# Altium project braking_io.PrjPcb (part 1 of 3)
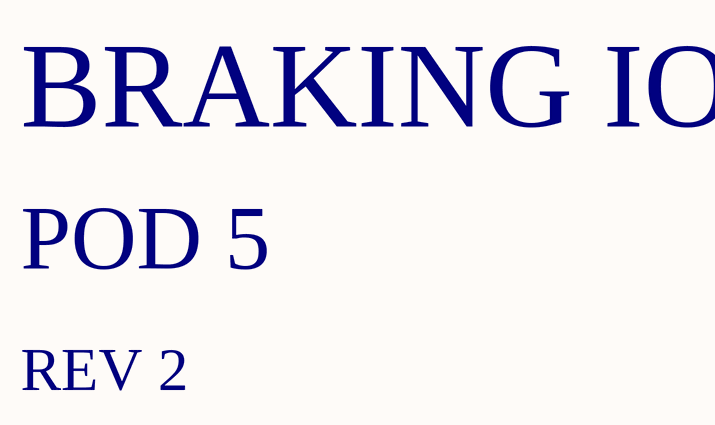
[diagram p0: braking_io.SchDoc]
11 sheets, 381 parts. Net scope: global (net labels, ports and power ports of the same name join across sheets).
Board file: braking_io.PcbDoc
Sheets:
  braking_io.SchDoc
  bus_filter.SchDoc
  power_7V.SchDoc
  power_5V.SchDoc
  power_24V.SchDoc
  solenoid.SchDoc
  solenoid_drv.SchDoc
  pressure.SchDoc
  telemetry_adc.SchDoc
  retro.SchDoc
  unity_gain_buffer.SchDoc

## Sheet braking_io.SchDoc: Braking IO PCB
size A4; Organization: Badgerloop Electrical; Address1: 133 Engineering Research Building; Address2: 1500 Engineering Drive; Address3: Madison, Wi 53706

### Notes on the sheet
- BRAKING IO
- POD 5
- REV 2
- Title
- Engineer:
- Date:
- Time:
- Revision:
- Sheet
- of
- File:

## Sheet bus_filter.SchDoc: Bus Filter
size A4; Organization: Badgerloop Electrical; Address1: 133 Engineering Research Building; Address2: 1500 Engineering Drive; Address3: Madison, Wi 53706
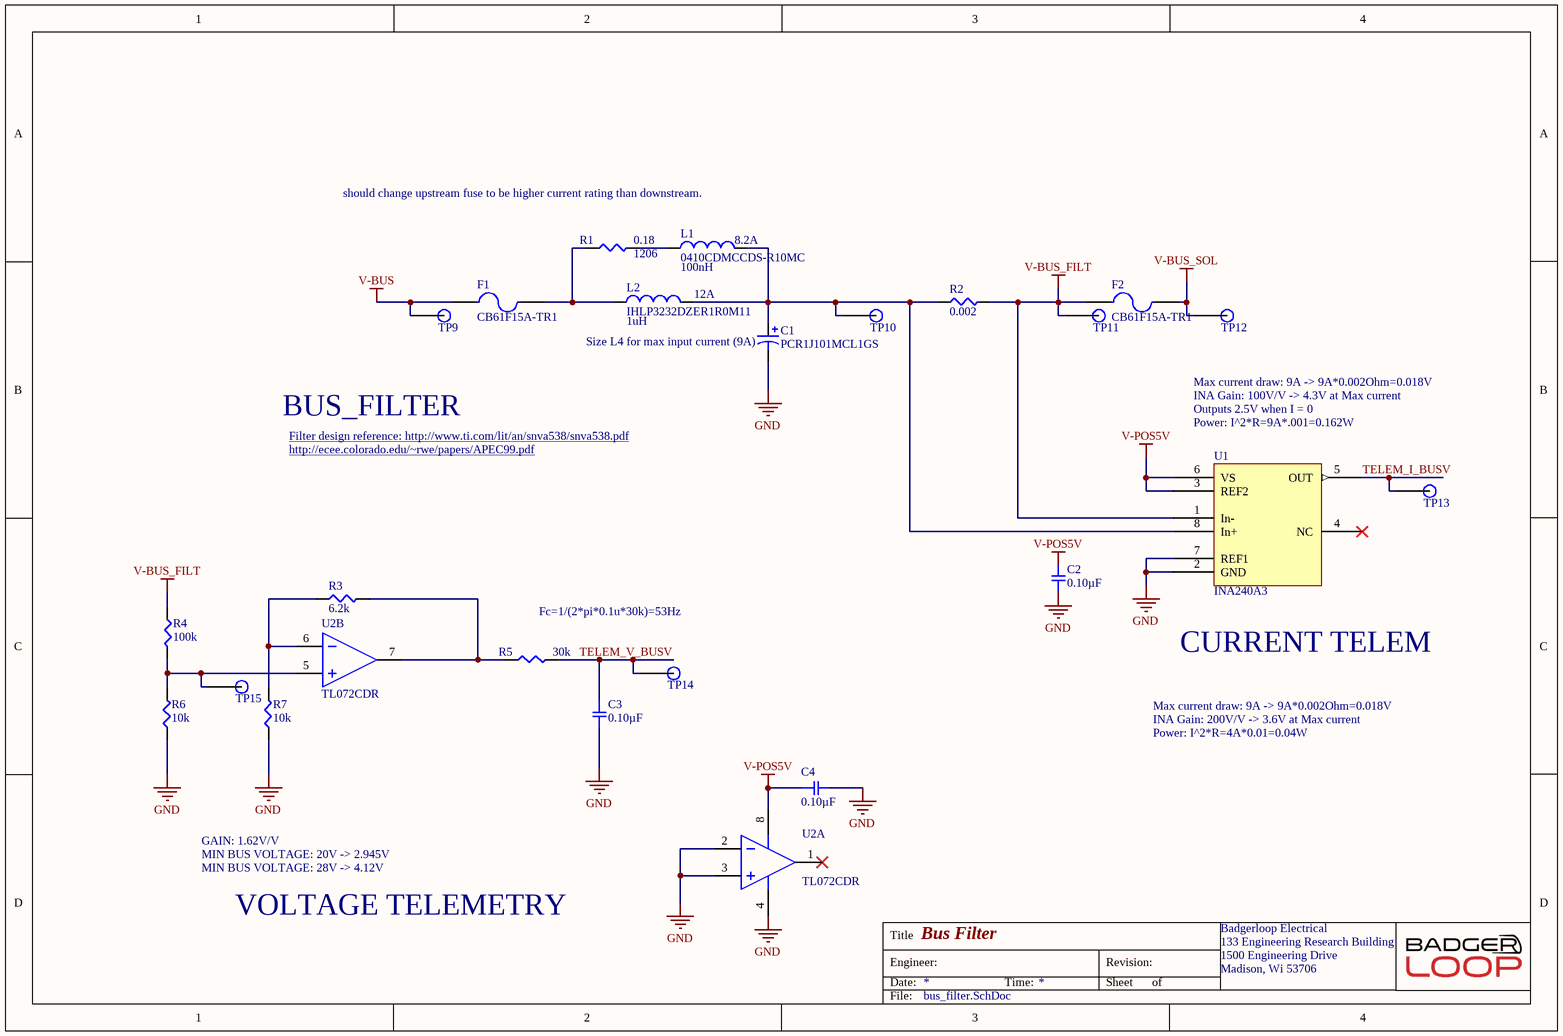
[diagram p1: bus_filter.SchDoc]

### Parts
C1  PCR1J101MCL1GS  [CAPAE110103X126M]
C2  0.10µF  [SMD-0805C]
C3  0.10µF  [SMD-0805C]
C4  0.10µF  [SMD-0805C]
F1  CB61F15A-TR1  [RESC6132X26N]
F2  CB61F15A-TR1  [RESC6132X26N]
L1  0410CDMCCDS-R10MC  Inductance: 100nH  Saturation Current: 8.2A  [INDM4442X20N]
L2  IHLP3232DZER1R0M11  Saturation Current: 12A  Inductance: 1uH  [INDM8682X40N]
R1  0.18  Supplier Device Package: 1206  [SMD-1206-RES]
R2  0.002  [SMD-1206-RES]
R3  6.2k  [SMD-0805-RES]
R4  100k  [SMD-0805-RES]
R5  30k  [SMD-0805-RES]
R6  10k  [SMD-0805-RES]
R7  10k  [SMD-0805-RES]
TP9  TP  [Test Point]  (value not drawn)
TP10  TP  [Test Point]  (value not drawn)
TP11  TP  [Test Point]  (value not drawn)
TP12  TP  [Test Point]  (value not drawn)
TP13  TP  [Test Point]  (value not drawn)
TP14  TP  [Test Point]  (value not drawn)
TP15  TP  [Test Point]  (value not drawn)
U1  INA240A3  [SOIC127P600X175-8N]
U2  TL072CDR  [SOP127P600X175-8N]  (parts A,B of 2)

### Nets
GND: C1.2 C2.1 C3.2 C4.2 R6.1 R7.1 U1.2(GND) U1.7(REF1) U2.2(IN-) U2.3(IN+) U2.4(V-)
V-BUS: F1.1 TP9.1
V-BUS_FILT: F2.1 R2.2 R4.1 TP11.1 U1.1(In-)
V-BUS_SOL: F2.2 TP12.1
V-POS5V: C2.2 C4.1 U1.3(REF2) U1.6(VS) U2.8(V+)
TELEM_I_BUSV: TP13.1 U1.5(OUT)
TELEM_V_BUSV: C3.1 R5.2 TP14.1
NetC1_1: C1.1 L1.2 L2.2 R2.1 TP10.1 U1.8(In+)
NetF1_2: F1.2 L2.1 R1.1
NetL1_1: L1.1 R1.2
NetR3_1: R3.1 R7.2 U2.6(IN-)
NetR3_2: R3.2 R5.1 U2.7(OUT)
NetR4_2: R4.2 R6.2 TP15.1 U2.5(IN+)

Not connected (* = marked no-connect by the designer): U1 4(NC)*; U2 1(OUT)*

### Notes on the sheet
- should change upstream fuse to be higher current rating than downstream.
- (near C1) Size L4 for max input current (9A)
- Max current draw: 9A -> 9A*0.002Ohm=0.018V
- BUS_FILTER
- Filter design reference: http://www.ti.com/lit/an/snva538/snva538.pdf <http://www.ti.com/lit/an/snva538/snva538.pdf>
- INA Gain: 100V/V -> 4.3V at Max current
- (near U1) Power: I^2*R=9A*.001=0.162W
- Outputs 2.5V when I = 0
- http://ecee.colorado.edu/~rwe/papers/APEC99.pdf
- Fc=1/(2*pi*0.1u*30k)=53Hz
- CURRENT TELEM
- INA Gain: 200V/V -> 3.6V at Max current
- Power: I^2*R=4A*0.01=0.04W
- GAIN: 1.62V/V
- MIN BUS VOLTAGE: 20V -> 2.945V
- MIN BUS VOLTAGE: 28V -> 4.12V
- VOLTAGE TELEMETRY
- Title
- Engineer:
- Date:
- Time:
- Revision:
- Sheet
- of
- File:

### Library data of the parts
C1 = PCR1J101MCL1GS: CAP ALUM POLY 100UF 20% 63V SMD; Manufacturer: Nichicon; ESR (Equivalent Series Resistance): 24mR; Ripple Current: 3A; Leakage Current: 3uA; Life (Hours): 4000Hour; Dissipation Factor: 0.08%; Supplier 1: Digi-Key; Manufacturer Part Number: PCR1J101MCL1GS; Stock 1: 11476; Pricing 1: 1=3.63000, 10=2.92800, 100=2.28380 (USD); RoHS: Yes; Mount: Surface Mount,PCB; Case/Package: Radial; Weight: 0.045856oz; Min Operating Temperature: -55°C; Max Operating Temperature: 125°C; Capacitance: 100uF; Tolerance: 20%; Voltage Rating (DC): 63V; Package Quantity: 1; Packaging: Tape and Reel; Voltage Rating: 63V; Termination: SMD/SMT; Voltage: 63V; Diameter: 10mm; Length: 12.7mm; Height: 12.7mm; Height - Seated (Max): 0.504inch; Depth: 10.3mm; Lead Pitch: 4.6mm; Lead Free: Lead Free; ComponentLink1URL: https://datasheet.ciiva.com/29551/e-ch-ta-29551389.pdf?src-supplier=Digi-Key; ComponentLink1Description: https://datasheet.ciiva.com/29551/e-ch-ta-29551389.pdf?src-supplier=Digi-Key; ComponentLink2URL: https://datasheet.ciiva.com/29551/e-ch-ta-29551390.pdf?src-supplier=Digi-Key; ComponentLink2Description: https://datasheet.ciiva.com/29551/e-ch-ta-29551390.pdf?src-supplier=Digi-Key; ComponentLink3URL: https://datasheet.ciiva.com/29551/e-ch-ta-29551391.pdf?src-supplier=Digi-Key; ComponentLink3Description: https://datasheet.ciiva.com/29551/e-ch-ta-29551391.pdf?src-supplier=Digi-Key; Supplier Part Number 1: 493-13783-1-ND
C2 C4 = GRM21B7U1A104JA01L: CAP CER 0.1UF 10V U2J 0805; Manufacturer: Murata Electronics North America; Factory Stock: 0; Unit Price (USD): 0.4; Minimum Quantity: 1; Tolerance: ±5%; Datasheets: http://www.murata.com/~/media/webrenewal/support/library/catalog/products/capacitor/mlcc/c02e.pdf; Image: //media.digikey.com/Renders/Murata%20Renders/0805%20(2012%20Metric)%20.85mm.jpg; Digi-Key Part Number: 490-11592-1-ND; Part Number: GRM21B7U1A104JA01L; Quantity Available: 3390; @ qty: 0; Packaging: Cut Tape (CT); Series: GRM; Part Status: Active; Value: 0.10µF; Voltage: 10V; Temperature Coefficient: U2J; Operating Temperature: -55°C ~ 125°C; Features: -; Ratings: -; Applications: General Purpose; Mounting Type: Surface Mount, MLCC; Package / Case: 0805 (2012 Metric); Size / Dimension: 0.079" L x 0.049" W (2.00mm x 1.25mm); Height - Seated (Max): -; Thickness (Max): 0.053" (1.35mm); Lead Spacing: -; Lead Style: -
C3 = GRM219R71C104KA01D: CAP CER 0.1UF 16V X7R 0805; Manufacturer: Murata Electronics North America; Factory Stock: 0; Unit Price (USD): 0.13; Minimum Quantity: 1; Tolerance: ±10%; Datasheets: http://www.murata.com/~/media/webrenewal/support/library/catalog/products/capacitor/mlcc/c02e.pdf; Image: //media.digikey.com/Renders/Murata%20Renders/0805%20(2012%20Metric)%20.85mm.jpg; Digi-Key Part Number: 490-1683-1-ND; Part Number: GRM219R71C104KA01D; Quantity Available: 265464; @ qty: 0; Packaging: Cut Tape (CT); Series: GRM; Part Status: Active; Value: 0.10µF; Voltage: 16V; Temperature Coefficient: X7R; Operating Temperature: -55°C ~ 125°C; Features: -; Ratings: -; Applications: General Purpose; Mounting Type: Surface Mount, MLCC; Package / Case: 0805 (2012 Metric); Size / Dimension: 0.079" L x 0.049" W (2.00mm x 1.25mm); Height - Seated (Max): -; Thickness (Max): 0.037" (0.95mm); Lead Spacing: -; Lead Style: -
F1 F2 = CB61F15A-TR1: Manufacturer: Eaton; Current Rating: 15A; Voltage Rating (AC): 125V; DC Cold Resistance: 4mR; Fuse Type: Board Mount (Cartridge Style Excluded); Approvals: cULus,PSE; Supplier 1: Digi-Key; Manufacturer Part Number: CB61F15A-TR1; Stock 1: 11809; Pricing 1: 1=1.15000, 5=1.11800, 10=1.04600, 50=0.86600, 100=0.72160, 250=0.70356, 500=0.59532 (USD); RoHS: Yes; Mount: Surface Mount; Case/Package: SMD/SMT; Packaging: Tape and Reel; Voltage Rating (DC): 125V; Voltage Rating: 125V; Length: 0.24inch; Height: 0.101inch; Width: 0.101inch; Depth: 2.57mm; Lead Free: Lead Free; ComponentLink1URL: http://components.arrow.com/part/dataview/0323_05918082?src-supplier=Arrow+Europe; ComponentLink1Description: http://components.arrow.com/part/dataview/0323_05918082?src-supplier=Arrow+Europe; ComponentLink2URL: http://www.cooperindustries.com/content/dam/public/bussmann/Electronics/Resources/product-datasheets/bus-elx-ds-4377-cb61f.pdf?src-supplier=Avnet+Asia; ComponentLink2Description: http://www.cooperindustries.com/content/dam/public/bussmann/Electronics/Resources/product-datasheets/bus-elx-ds-4377-cb61f.pdf?src-supplier=Avnet+Asia; ComponentLink3URL: http://www.cooperindustries.com/content/dam/public/bussmann/Electronics/Resources/product-datasheets/bus-elx-ds-4377-cb61f.pdf?src-supplier=Avnet; ComponentLink3Description: http://www.cooperindustries.com/content/dam/public/bussmann/Electronics/Resources/product-datasheets/bus-elx-ds-4377-cb61f.pdf?src-supplier=Avnet; ComponentLink4URL: http://www.cooperindustries.com/content/dam/public/bussmann/Electronics/Resources/product-datasheets/bus-elx-ds-4377-cb61f.pdf?src-supplier=Digi-Key; ComponentLink4Description: http://www.cooperindustries.com/content/dam/public/bussmann/Electronics/Resources/product-datasheets/bus-elx-ds-4377-cb61f.pdf?src-supplier=Digi-Key; Supplier Part Number 1: 283-4104-1-ND
L1 = 0410CDMCCDS-R10MC: Manufacturer: Sumida; Supplier 1: Digi-Key; Manufacturer Part Number: 0410CDMCCDS-R10MC; Stock 1: 5994; Pricing 1: 1=0.93000, 10=0.81700, 100=0.58360, 500=0.49024, 1000=0.39687 (USD); RoHS: No; Supplier Part Number 1: 308-2523-1-ND
L2 = IHLP3232DZER1R0M11: Fixed Inductors 1uH 20% Low Profile; Manufacturer: Vishay Dale; Core Material: Metal,Composite,Ferrite; Current Rating: 18.2A; Shielding: Shielded; Self Resonant Frequency: 49MHz; DC Resistance (DCR): 4.63mR; Test Frequency: 100kHz; Supplier 1: Digi-Key; Manufacturer Part Number: IHLP3232DZER1R0M11; Stock 1: 9463; Pricing 1: 1=1.61000, 10=1.49500, 100=1.08100 (USD); RoHS: Yes; Mount: Surface Mount; Case/Package: 3232; Number of Pins: 2; Min Operating Temperature: -55°C; Max Operating Temperature: 125°C; Inductance Tolerance: 20%; Packaging: Tape and Reel; Tolerance: 20%; Package Quantity: 500; Max DC Current: 18.2A; Termination: SMD/SMT; RMS Current (Irms): 18.2A; Military Standard: Not; Length: 8.64mm; Height: 4mm; Width: 0.322inch; Height - Seated (Max): 0.157inch; Depth: 8.94mm; Radiation Hardening: No; REACH SVHC: Unknown; Lead Free: Lead Free; ComponentLink1URL: https://datasheet.ciiva.com/6692/ihlp-3232dz-11-6692199.pdf?src-supplier=Digi-Key; ComponentLink1Description: https://datasheet.ciiva.com/6692/ihlp-3232dz-11-6692199.pdf?src-supplier=Digi-Key; ComponentLink2URL: https://datasheet.ciiva.com/6692/ihlp-3232dz-11-6692200.pdf?src-supplier=Digi-Key; ComponentLink2Description: https://datasheet.ciiva.com/6692/ihlp-3232dz-11-6692200.pdf?src-supplier=Digi-Key; ComponentLink3URL: https://datasheet.ciiva.com/6692/ihlp-3232dz-11-6692201.pdf?src-supplier=Digi-Key; ComponentLink3Description: https://datasheet.ciiva.com/6692/ihlp-3232dz-11-6692201.pdf?src-supplier=Digi-Key; ComponentLink4URL: https://datasheet.ciiva.com/17113/70231623-17113262.pdf?src-supplier=Allied+Electronics; ComponentLink4Description: https://datasheet.ciiva.com/17113/70231623-17113262.pdf?src-supplier=Allied+Electronics; Supplier Part Number 1: 541-1348-1-ND
R1 = ERJ-8BSFR18V: RES SMD 0.18 OHM 1% 1/2W 1206; Manufacturer: Panasonic Electronic Components; Factory Stock: 0; Unit Price (USD): 0.11739; @ qty: 1500; Minimum Quantity: 1; Power (Watts): 0.5W, 1/2W; Temperature Coefficient: ±250ppm/°C; Part Number: ERJ-8BSFR18V; Datasheets: https://industrial.panasonic.com/cdbs/www-data/pdf/RDA0000/AOA0000C239.pdf; Image: //media.digikey.com/Renders/Panasonic%20Renders/ERJ-1206%20Pkg.jpg; Digi-Key Part Number: P17683CT-ND; Quantity Available: 1772; Packaging: Cut Tape (CT); Series: ERJ; Part Status: Active; Value: 0.18; Tolerance: ±1%; Composition: Thick Film; Features: Automotive AEC-Q200, Current Sense; Operating Temperature: -55°C ~ 125°C; Package / Case: 1206 (3216 Metric); Size / Dimension: 0.126" L x 0.063" W (3.20mm x 1.60mm); Height - Seated (Max): 0.028" (0.70mm); Number of Terminations: 2; Failure Rate: -
R2 = CSNL1206FT2L00TR: RES SMD 0.002 OHM 1% 1W 1206; Manufacturer: Stackpole Electronics; Resistance: 2mR; Temperature Coefficient: 50ppm/°C; ComponentLink1URL: https://www.seielect.com/Catalog/SEI-CSNL.pdf?src-supplier=Avnet; ComponentLink1Description: https://www.seielect.com/Catalog/SEI-CSNL.pdf?src-supplier=Avnet; ComponentLink2URL: https://www.seielect.com/catalog/SEI-Packaging.pdf?src-supplier=Digi-Key; ComponentLink2Description: https://www.seielect.com/catalog/SEI-Packaging.pdf?src-supplier=Digi-Key; Supplier 1: Digi-Key; Manufacturer Part Number: CSNL1206FT2L00; Stock 1: 23112; Pricing 1: 1=0.68, 10=0.566, 25=0.4852, 50=0.4366, 100=0.38, 250=0.33956, 500=0.2749, 1000=0.22234 (USD); Mount: Surface Mount; Case/Package: 1206; Case Code (Metric): 3216; Case Code (Imperial): 1206; Contact Plating: Tin,Matte; Min Operating Temperature: -55°C; Max Operating Temperature: 170°C; Packaging: Tape and Reel; Tolerance: 1%; Power Rating: 1W; Composition: Metal Foil; Number of Terminations: 2; Max Power Dissipation: 1W; Features: Moisture Resistant; Length: 0.126inch; Height: 0.035inch; Width: 0.063inch; Radiation Hardening: No; Lead Free: Lead Free; Supplier Part Number 1: CSNL1206FT2L00DKR-ND
R3 = ERJ-P06J622V: RES SMD 6.2K OHM 5% 1/2W 0805; Manufacturer: Panasonic Electronic Components; Factory Stock: 0; Unit Price (USD): 0.01839; @ qty: 1500; Minimum Quantity: 1; Power (Watts): 0.5W, 1/2W; Temperature Coefficient: ±200ppm/°C; Part Number: ERJ-P06J622V; Datasheets: https://industrial.panasonic.com/cdbs/www-data/pdf/RDA0000/AOA0000C243.pdf; Image: //media.digikey.com/Renders/Panasonic%20Renders/ERJ-0805%20Pkg.jpg; Digi-Key Part Number: P6.2KADCT-ND; Quantity Available: 14652; Packaging: Cut Tape (CT); Series: ERJ; Part Status: Active; Value: 6.2k; Tolerance: ±5%; Composition: Thick Film; Features: Automotive AEC-Q200, Pulse Withstanding; Operating Temperature: -55°C ~ 155°C; Package / Case: 0805 (2012 Metric); Supplier Device Package: 0805; Size / Dimension: 0.079" L x 0.049" W (2.00mm x 1.25mm); Height - Seated (Max): 0.028" (0.70mm); Number of Terminations: 2; Failure Rate: -
R4 = ERJ-P06J104V: RES SMD 100K OHM 5% 1/2W 0805; Manufacturer: Panasonic Electronic Components; Factory Stock: 0; Unit Price (USD): 0.01839; @ qty: 1500; Minimum Quantity: 1; Power (Watts): 0.5W, 1/2W; Temperature Coefficient: ±200ppm/°C; Part Number: ERJ-P06J104V; Datasheets: https://industrial.panasonic.com/cdbs/www-data/pdf/RDA0000/AOA0000C243.pdf; Image: //media.digikey.com/Renders/Panasonic%20Renders/ERJ-0805%20Pkg.jpg; Digi-Key Part Number: P100KADCT-ND; Quantity Available: 82264; Packaging: Cut Tape (CT); Series: ERJ; Part Status: Active; Value: 100k; Tolerance: ±5%; Composition: Thick Film; Features: Automotive AEC-Q200, Pulse Withstanding; Operating Temperature: -55°C ~ 155°C; Package / Case: 0805 (2012 Metric); Supplier Device Package: 0805; Size / Dimension: 0.079" L x 0.049" W (2.00mm x 1.25mm); Height - Seated (Max): 0.028" (0.70mm); Number of Terminations: 2; Failure Rate: -
R5 = ERJ-6ENF3002V: RES SMD 30K OHM 1% 1/8W 0805; Manufacturer: Panasonic Electronic Components; Factory Stock: 0; Unit Price (USD): 0.00729; @ qty: 1500; Minimum Quantity: 1; Power (Watts): 0.125W, 1/8W; Temperature Coefficient: ±100ppm/°C; Part Number: ERJ-6ENF3002V; Datasheets: http://industrial.panasonic.com/www-cgi/jvcr13pz.cgi?E+PZ+3+AOA0002+ERJ6ENF3002V+7+WW; Image: //media.digikey.com/Renders/Panasonic%20Renders/ERJ-0805%20Pkg.jpg; Digi-Key Part Number: P30.0KCCT-ND; Quantity Available: 88046; Packaging: Cut Tape (CT); Series: ERJ; Part Status: Active; Value: 30k; Tolerance: ±1%; Composition: Thick Film; Features: Automotive AEC-Q200; Operating Temperature: -55°C ~ 155°C; Package / Case: 0805 (2012 Metric); Supplier Device Package: 0805; Size / Dimension: 0.079" L x 0.049" W (2.00mm x 1.25mm); Height - Seated (Max): 0.028" (0.70mm); Number of Terminations: 2; Failure Rate: -
R6 R7 = ERJ-P06J103V: RES SMD 10K OHM 5% 1/2W 0805; Manufacturer: Panasonic Electronic Components; Factory Stock: 0; Unit Price (USD): 0.01839; @ qty: 1500; Minimum Quantity: 1; Power (Watts): 0.5W, 1/2W; Temperature Coefficient: ±200ppm/°C; Part Number: ERJ-P06J103V; Datasheets: https://industrial.panasonic.com/cdbs/www-data/pdf/RDA0000/AOA0000C243.pdf; Image: //media.digikey.com/Renders/Panasonic%20Renders/ERJ-0805%20Pkg.jpg; Digi-Key Part Number: P10KADCT-ND; Quantity Available: 413576; Packaging: Cut Tape (CT); Series: ERJ; Part Status: Active; Value: 10k; Tolerance: ±5%; Composition: Thick Film; Features: Automotive AEC-Q200, Pulse Withstanding; Operating Temperature: -55°C ~ 155°C; Package / Case: 0805 (2012 Metric); Supplier Device Package: 0805; Size / Dimension: 0.079" L x 0.049" W (2.00mm x 1.25mm); Height - Seated (Max): 0.028" (0.70mm); Number of Terminations: 2; Failure Rate: -
TP9-TP15 = TP: SMD TEST POINT
U1 = INA240A3: IC AMP CURRENT SENSE 8-TSSOP 100V/V; Manufacturer: Texas Instruments; Number of Circuits: 1; Slew Rate: 2V/µs; -3db Bandwidth: 400kHz; Input Bias Current: 90uA; Input Offset Voltage (Vos): 5uV; Operating Supply Current: 1.8mA; Supplier 1: Digi-Key; Stock 1: 4680; Pricing 1: 1=2.65, 10=2.377, 25=2.2428, 100=1.7943, 250=1.56996, 500=1.52512, 1000=1.21113 (USD); Mount: Surface Mount; Case/Package: TSSOP; Number of Pins: 8; Min Operating Temperature: -40°C; Max Operating Temperature: 125°C; Packaging: Tape and Reel; ComponentLink1URL: http://www.ti.com/general/docs/lit/getliterature.tsp?genericPartNumber=INA240&fileType=pdf&src-supplier=Farnell; ComponentLink1Description: http://www.ti.com/general/docs/lit/getliterature.tsp?genericPartNumber=INA240&fileType=pdf&src-supplier=Farnell; ComponentLink2URL: http://www.ti.com/lit/ds/symlink/ina240.pdf?src-supplier=Digi-Key; ComponentLink2Description: http://www.ti.com/lit/ds/symlink/ina240.pdf?src-supplier=Digi-Key; Supplier Part Number 1: 296-45090-1-ND
U2 = TL072CDR: IC OPAMP JFET 3MHZ 8SOIC; Manufacturer: Texas Instruments; Voltage Gain: 106.02dB; Min Dual Supply Voltage: 3.5V; Max Dual Supply Voltage: 18V; Nominal Supply Current: 5mA; Common Mode Rejection Ratio: 70dB; Number of Channels: 2; Slew Rate: 13V/µs; Max I/O Voltage: 10mV; Input Bias Current: 200pA; Operating Supply Current: 1.4mA; Dual Supply Voltage: 9V; Supplier 1: Digi-Key; Stock 1: 21821; Pricing 1: 1=0.41, 10=0.334, 100=0.2059, 500=0.1562, 1000=0.11715 (USD); Case/Package: D; Number of Pins: 8; Contact Plating: Gold; Min Operating Temperature: -40°C; Max Operating Temperature: 85°C; Package Quantity: 1; Packaging: Tape and Reel; Unity Gain Bandwidth Product: 3MHz; Bandwidth: 3MHz; Nominal Gain Bandwidth Product: 3MHz; Number of Circuits: 2; Gain Bandwidth Product: 3MHz; Input Offset Voltage (Vos): 10mV; Number of Elements: 2; Max Supply Voltage: 18V; Number of Amplifiers: 2; Length: 4.9mm; Height: 1.58mm; Width: 3.91mm; Radiation Hardening: No; Lead Free: Lead Free; REACH SVHC: No SVHC; ComponentLink1URL: http://www.ti.com/lit/ds/symlink/tl071a.pdf?src-supplier=Digi-Key; ComponentLink1Description: http://www.ti.com/lit/ds/symlink/tl071a.pdf?src-supplier=Digi-Key; ComponentLink2URL: http://www.ti.com/general/docs/lit/getliterature.tsp?genericPartNumber=TL072&&fileType=pdf&src-supplier=Avnet; ComponentLink2Description: http://www.ti.com/general/docs/lit/getliterature.tsp?genericPartNumber=TL072&&fileType=pdf&src-supplier=Avnet; ComponentLink3URL: http://www.farnell.com/datasheets/1882732.pdf?src-supplier=Element14; ComponentLink3Description: http://www.farnell.com/datasheets/1882732.pdf?src-supplier=Element14; Supplier Part Number 1: 296-1282-6-ND

## Sheet power_7V.SchDoc: 7V SUPPLY
size A4; Organization: Badgerloop Electrical; Address1: 133 Engineering Research Building; Address2: 1500 Engineering Drive; Address3: Madison, Wi 53706
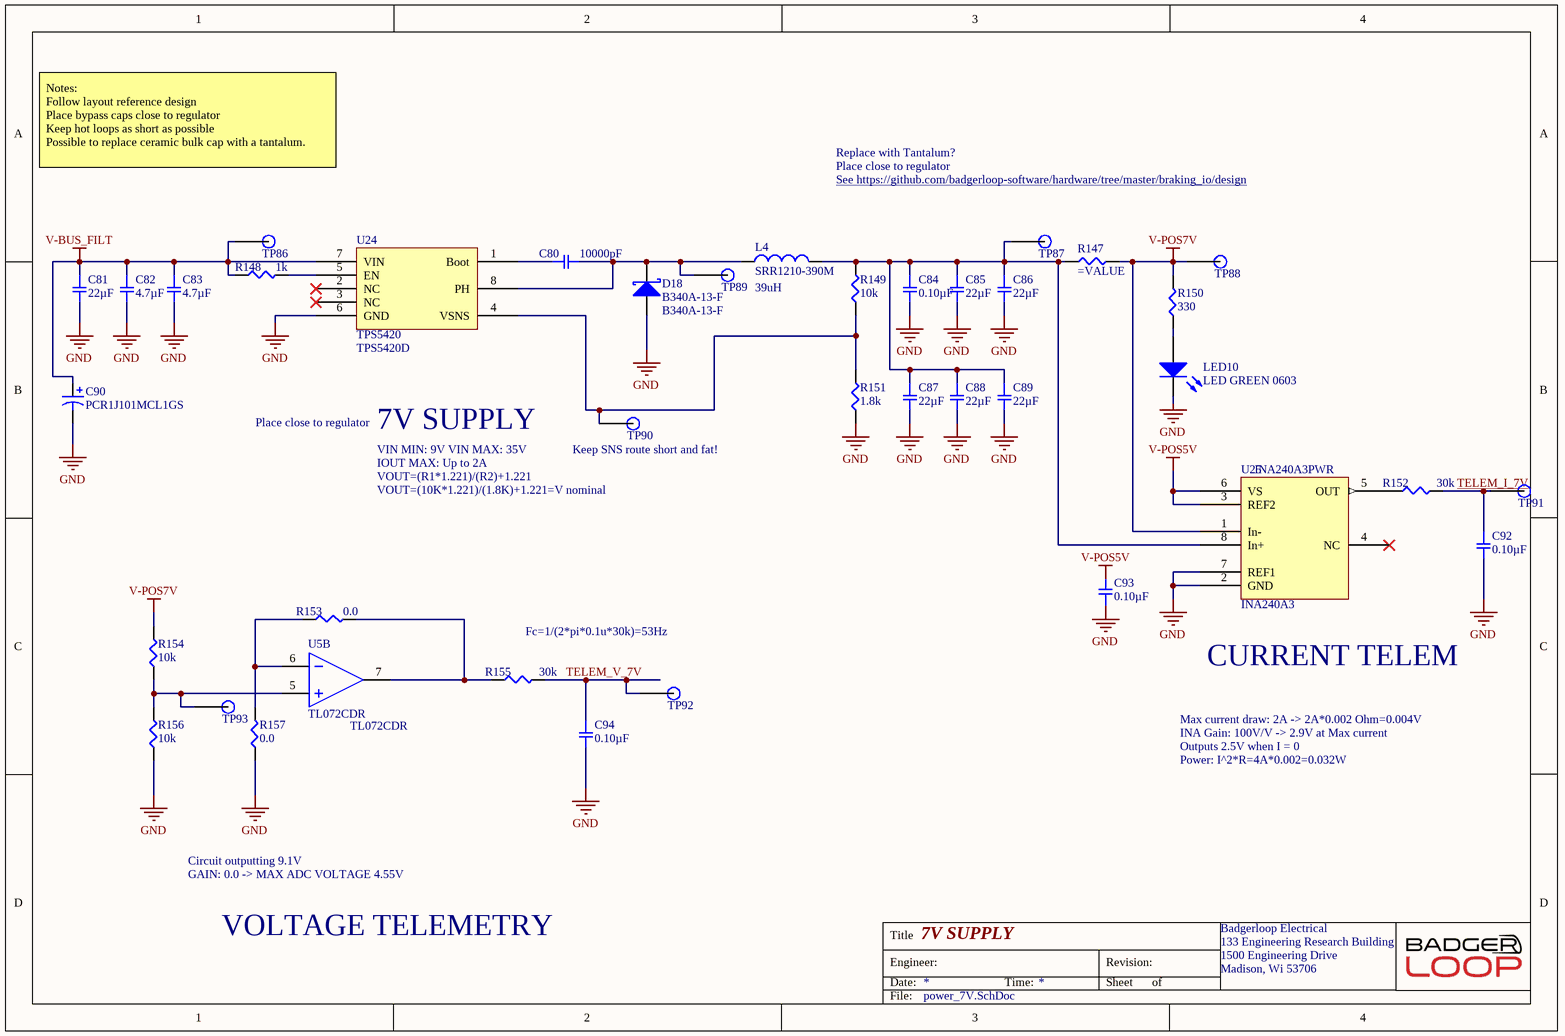
[diagram p2: power_7V.SchDoc]

### Parts
C80  10000pF  [SMD-0805C]
C81  22µF  [SMD-1206C]
C82  4.7µF  [SMD-1206C]
C83  4.7µF  [SMD-1206C]
C84  0.10µF  [SMD-0805C]
C85  22µF  [SMD-1206C]
C86  22µF  [SMD-1206C]
C87  22µF  [SMD-1206C]
C88  22µF  [SMD-1206C]
C89  22µF  [SMD-1206C]
C90  PCR1J101MCL1GS  [CAPAE110103X126M]
C92  0.10µF  [SMD-0805C]
C93  0.10µF  [SMD-0805C]
C94  0.10µF  [SMD-0805C]
D18  B340A-13-F  [DIOM4326X20N]
L4  SRR1210-390M  Inductance: 39uH  [INDM120120X100N]
LED10  LED GREEN 0603  [LED 0603 GREEN]
R147  (no value)  [SMD-1206-RES]
R148  1k  [SMD-0805-RES]
R149  10k  [SMD-0805-RES]
R150  330  [SMD-0805-RES]
R151  1.8k  [SMD-0805-RES]
R152  30k  [SMD-0805-RES]
R153  0.0  [SMD-0805-RES]
R154  10k  [SMD-0805-RES]
R155  30k  [SMD-0805-RES]
R156  10k  [SMD-0805-RES]
R157  0.0  [SMD-0805-RES]
TP86  TP  [Test Point]  (value not drawn)
TP87  TP  [Test Point]  (value not drawn)
TP88  TP  [Test Point]  (value not drawn)
TP89  TP  [Test Point]  (value not drawn)
TP90  TP  [Test Point]  (value not drawn)
TP91  TP  [Test Point]  (value not drawn)
TP92  TP  [Test Point]  (value not drawn)
TP93  TP  [Test Point]  (value not drawn)
U5  TL072CDR  [SOP127P600X175-8N]  (part B of 2)
U24  TPS5420  Manufacturer Part Number: TPS5420D  [SOP127P600X175-8N]
U25  INA240A3  Manufacturer Part Number: INA240A3PWR  [SOIC127P600X175-8N]

### Nets
GND: C81.2 C82.2 C83.2 C84.2 C85.2 C86.2 C87.2 C88.2 C89.2 C90.2 C92.2 C93.1 C94.2 D18.1(A) LED10.2(K) R151.1 R156.1 R157.1 U24.6(GND) U25.2(GND) U25.7(REF1)
V-BUS_FILT: C81.1 C82.1 C83.1 C90.1 R148.1 TP86.1 U24.7(VIN)
V-POS5V: C93.2 U25.3(REF2) U25.6(VS)
V-POS7V: R147.2 R150.2 R154.2 TP88.1 U25.1(In-)
TELEM_I_7V: C92.1 R152.2 TP91.1
TELEM_V_7V: C94.1 R155.2 TP92.1
NetC80_1: C80.1 U24.1(Boot)
NetC80_2: C80.2 D18.2(K) L4.1 TP89.1 U24.8(PH)
NetC84_1: C84.1 C85.1 C86.1 C87.1 C88.1 C89.1 L4.2 R147.1 R149.2 TP87.1 U25.8(In+)
NetLED10_1: LED10.1(A) R150.1
NetR148_2: R148.2 U24.5(EN)
NetR149_1: R149.1 R151.2 TP90.1 U24.4(VSNS)
NetR152_1: R152.1 U25.5(OUT)
NetR153_1: R153.1 R157.2 U5.6(IN-)
NetR153_2: R153.2 R155.1 U5.7(OUT)
NetR154_1: R154.1 R156.2 TP93.1 U5.5(IN+)

Not connected (* = marked no-connect by the designer): U24 2(NC)* 3(NC)*; U25 4(NC)*

### Notes on the sheet
- Notes:
  Follow layout reference design
  Place bypass caps close to regulator
  Keep hot loops as short as possible
  Possible to replace ceramic bulk cap with a tantalum.
- Replace with Tantalum?
- Place close to regulator
- See https://github.com/badgerloop-software/hardware/tree/master/braking_io/design <https://github.com/badgerloop-software/hardware/tree/master/braking_io/design>
- 7V SUPPLY
- VIN MIN: 9V VIN MAX: 35V
- IOUT MAX: Up to 2A
- VOUT=(R1*1.221)/(R2)+1.221
- VOUT=(10K*1.221)/(1.8K)+1.221=V nominal
- (near TP90) Keep SNS route short and fat!
- Fc=1/(2*pi*0.1u*30k)=53Hz
- CURRENT TELEM
- Max current draw: 2A -> 2A*0.002 Ohm=0.004V
- Power: I^2*R=4A*0.002=0.032W
- INA Gain: 100V/V -> 2.9V at Max current
- Outputs 2.5V when I = 0
- GAIN: 0.0 -> MAX ADC VOLTAGE 4.55V
- Circuit outputting 9.1V
- VOLTAGE TELEMETRY
- Title
- Engineer:
- Date:
- Time:
- Revision:
- Sheet
- of
- File:

### Library data of the parts
C80 = GC321AD72E103KX01D: CAP CER 10000PF 250V X7T 0805; Manufacturer: Murata Electronics North America; Factory Stock: 0; Unit Price (USD): 0.3; Minimum Quantity: 1; Tolerance: ±10%; Datasheets: http://search.murata.co.jp/Ceramy/image/img/A01X/G101/ENG/GC321AD72E103KX01-01.pdf; Image: //media.digikey.com/Renders/Murata%20Renders/0805(GC3)200x125.jpg; Digi-Key Part Number: 490-13986-1-ND; Part Number: GC321AD72E103KX01D; Quantity Available: 4000; @ qty: 0; Packaging: Cut Tape (CT); Series: GC3; Part Status: Active; Value: 10000pF; Voltage: 250V; Temperature Coefficient: X7T; Operating Temperature: -55°C ~ 125°C; Features: -; Ratings: AEC-Q200; Applications: Automotive; Mounting Type: Surface Mount, MLCC; Package / Case: 0805 (2012 Metric); Size / Dimension: 0.079" L x 0.049" W (2.00mm x 1.25mm); Height - Seated (Max): -; Thickness (Max): 0.039" (1.00mm); Lead Spacing: -; Lead Style: -
C81 C85-C89 = GRT31CR61E226ME01L: CAP CER 22UF 25V X5R 1206; Manufacturer: Murata Electronics North America; Factory Stock: 0; Unit Price (USD): 0.52; Minimum Quantity: 1; Tolerance: ±20%; Datasheets: http://search.murata.co.jp/Ceramy/image/img/A01X/G101/ENG/GRT31CR61E226ME01-01.pdf; Image: //media.digikey.com/Renders/Murata%20Renders/GR331BD72E473KW01L.jpg; Digi-Key Part Number: 490-12451-1-ND; Part Number: GRT31CR61E226ME01L; Quantity Available: 4719; @ qty: 0; Packaging: Cut Tape (CT); Series: GRT; Part Status: Active; Value: 22µF; Voltage: 25V; Temperature Coefficient: X5R; Operating Temperature: -55°C ~ 85°C; Features: -; Ratings: AEC-Q200; Applications: Automotive; Mounting Type: Surface Mount, MLCC; Package / Case: 1206 (3216 Metric); Size / Dimension: 0.126" L x 0.063" W (3.20mm x 1.60mm); Height - Seated (Max): -; Thickness (Max): 0.071" (1.80mm); Lead Spacing: -; Lead Style: -
C82 C83 = GCM31CC71H475KA03L: CAP CER 4.7UF 50V X7S 1206; Manufacturer: Murata Electronics North America; Factory Stock: 0; Unit Price (USD): 0.57; Minimum Quantity: 1; Tolerance: ±10%; Datasheets: http://www.murata.com/~/media/webrenewal/support/library/catalog/products/capacitor/mlcc/c03e.ashx; Image: //media.digikey.com/Renders/Murata%20Renders/GR331BD72E473KW01L.jpg; Digi-Key Part Number: 490-11167-1-ND; Part Number: GCM31CC71H475KA03L; Quantity Available: 11700; @ qty: 0; Packaging: Cut Tape (CT); Series: GCM; Part Status: Active; Value: 4.7µF; Voltage: 50V; Temperature Coefficient: X7S; Operating Temperature: -55°C ~ 125°C; Features: -; Ratings: AEC-Q200; Applications: Automotive; Mounting Type: Surface Mount, MLCC; Package / Case: 1206 (3216 Metric); Size / Dimension: 0.126" L x 0.063" W (3.20mm x 1.60mm); Height - Seated (Max): -; Thickness (Max): 0.071" (1.80mm); Lead Spacing: -; Lead Style: -
C84 C93 = GRM21B7U1A104JA01L: as C2 on sheet bus_filter; Datasheets: http://www.murata.com/~/media/webrenewal/support/library/catalog/products/capacitor/mlcc/c02e.pdf; Image: //media.digikey.com/Renders/Murata%20Renders/0805%20(2012%20Metric)%20.85mm.jpg; Digi-Key Part Number: 490-11592-1-ND; Part Number: GRM21B7U1A104JA01L; Quantity Available: 3390; @ qty: 0; Packaging: Cut Tape (CT); Series: GRM; Part Status: Active; Value: 0.10µF; Voltage: 10V; Temperature Coefficient: U2J; Operating Temperature: -55°C ~ 125°C; Features: -; Ratings: -; Applications: General Purpose; Mounting Type: Surface Mount, MLCC; Package / Case: 0805 (2012 Metric); Size / Dimension: 0.079" L x 0.049" W (2.00mm x 1.25mm); Height - Seated (Max): -; Thickness (Max): 0.053" (1.35mm); Lead Spacing: -; Lead Style: -
C90 = PCR1J101MCL1GS: as C1 on sheet bus_filter; Supplier 1: Digi-Key; Manufacturer Part Number: PCR1J101MCL1GS; Stock 1: 11476; Pricing 1: 1=3.63000, 10=2.92800, 100=2.28380 (USD); RoHS: Yes; Mount: Surface Mount,PCB; Case/Package: Radial; Weight: 0.045856oz; Min Operating Temperature: -55°C; Max Operating Temperature: 125°C; Capacitance: 100uF; Tolerance: 20%; Voltage Rating (DC): 63V; Package Quantity: 1; Packaging: Tape and Reel; Voltage Rating: 63V; Termination: SMD/SMT; Voltage: 63V; Diameter: 10mm; Length: 12.7mm; Height: 12.7mm; Height - Seated (Max): 0.504inch; Depth: 10.3mm; Lead Pitch: 4.6mm; Lead Free: Lead Free; ComponentLink1URL: https://datasheet.ciiva.com/29551/e-ch-ta-29551389.pdf?src-supplier=Digi-Key; ComponentLink1Description: https://datasheet.ciiva.com/29551/e-ch-ta-29551389.pdf?src-supplier=Digi-Key; ComponentLink2URL: https://datasheet.ciiva.com/29551/e-ch-ta-29551390.pdf?src-supplier=Digi-Key; ComponentLink2Description: https://datasheet.ciiva.com/29551/e-ch-ta-29551390.pdf?src-supplier=Digi-Key; ComponentLink3URL: https://datasheet.ciiva.com/29551/e-ch-ta-29551391.pdf?src-supplier=Digi-Key; ComponentLink3Description: https://datasheet.ciiva.com/29551/e-ch-ta-29551391.pdf?src-supplier=Digi-Key; Supplier Part Number 1: 493-13783-1-ND
C92 C94 = GRM219R71C104KA01D: as C3 on sheet bus_filter; Datasheets: http://www.murata.com/~/media/webrenewal/support/library/catalog/products/capacitor/mlcc/c02e.pdf; Image: //media.digikey.com/Renders/Murata%20Renders/0805%20(2012%20Metric)%20.85mm.jpg; Digi-Key Part Number: 490-1683-1-ND; Part Number: GRM219R71C104KA01D; Quantity Available: 265464; @ qty: 0; Packaging: Cut Tape (CT); Series: GRM; Part Status: Active; Value: 0.10µF; Voltage: 16V; Temperature Coefficient: X7R; Operating Temperature: -55°C ~ 125°C; Features: -; Ratings: -; Applications: General Purpose; Mounting Type: Surface Mount, MLCC; Package / Case: 0805 (2012 Metric); Size / Dimension: 0.079" L x 0.049" W (2.00mm x 1.25mm); Height - Seated (Max): -; Thickness (Max): 0.037" (0.95mm); Lead Spacing: -; Lead Style: -
D18 = B340A-13-F: DIODE SCHOTTKY 40V 3A SMA; Manufacturer: Diodes; Element Configuration: Single; Peak Reverse Current: 500uA; Forward Voltage: 500mV; Max Forward Surge Current (Ifsm): 80A; Polarity: Standard; Capacitance: 250pF; Supplier 1: Digi-Key; Stock 1: 438328; Pricing 1: 1=0.42000, 10=0.33900, 100=0.23070, 500=0.17304, 1000=0.12978 (USD); RoHS: Yes; Mount: Surface Mount; Case/Package: SMA; Number of Pins: 2; Weight: 0.002258oz; Contact Plating: Tin,Matte; Min Operating Temperature: -55°C; Max Operating Temperature: 125°C; Forward Current: 3A; Max Repetitive Reverse Voltage (Vrrm): 40V; Packaging: Tape and Reel; Peak Non-Repetitive Surge Current: 80A; Package Quantity: 5000; Average Rectified Current: 3A; Termination: SMD/SMT; Voltage Rating (DC): 40V; Current Rating: 3A; Output Current: 3A; Current: 3A; Voltage: 40V; Max Reverse Voltage (DC): 40V; Length: 4.6mm; Height: 2.3mm; Width: 2.92mm; Radiation Hardening: No; REACH SVHC: No SVHC; Lead Free: Lead Free; ComponentLink1URL: https://datasheet.ciiva.com/26949/getdatasheetpartid-143394-26949352.pdf?src-supplier=Verical; ComponentLink1Description: https://datasheet.ciiva.com/26949/getdatasheetpartid-143394-26949352.pdf?src-supplier=Verical; ComponentLink2URL: https://datasheet.ciiva.com/4245/861ds30891-4245763.pdf?src-supplier=Arrow; ComponentLink2Description: https://datasheet.ciiva.com/4245/861ds30891-4245763.pdf?src-supplier=Arrow; ComponentLink3URL: https://datasheet.ciiva.com/1177/ds30891-1177476.pdf?src-supplier=Element14; ComponentLink3Description: https://datasheet.ciiva.com/1177/ds30891-1177476.pdf?src-supplier=Element14; ComponentLink4URL: https://datasheet.ciiva.com/913/ds30891-913638.pdf?src-supplier=Digi-Key; ComponentLink4Description: https://datasheet.ciiva.com/913/ds30891-913638.pdf?src-supplier=Digi-Key; ComponentLink5URL: https://datasheet.ciiva.com/46393/1911813-46393773.pdf?src-supplier=Element14; ComponentLink5Description: https://datasheet.ciiva.com/46393/1911813-46393773.pdf?src-supplier=Element14; ComponentLink6URL: https://datasheet.ciiva.com/1240/ds30891-1240228.pdf?src-supplier=Newark; ComponentLink6Description: https://datasheet.ciiva.com/1240/ds30891-1240228.pdf?src-supplier=Newark; ComponentLink7URL: https://datasheet.ciiva.com/913/ds30891-913637.pdf?src-supplier=Digi-Key; ComponentLink7Description: https://datasheet.ciiva.com/913/ds30891-913637.pdf?src-supplier=Digi-Key; ComponentLink8URL: https://datasheet.ciiva.com/913/ds30891-913639.pdf?src-supplier=Digi-Key; ComponentLink8Description: https://datasheet.ciiva.com/913/ds30891-913639.pdf?src-supplier=Digi-Key; Supplier Part Number 1: B340A-FDICT-ND; Manufacturer Part Number: B340A-13-F
L4 = SRR1210-390M: FIXED IND 39UH 4.2A 66 MOHM SMD; Manufacturer: Bourns; Core Material: Ferrite; Tolerance: 20%; DC Resistance (DCR): 66mR; Saturation Current: 3.5A; Shielding: Shielded; Q Factor: 16; Self Resonant Frequency: 4.5MHz; Test Frequency: 100kHz; Supplier 1: Digi-Key; Manufacturer Part Number: SRR1210-390M; Stock 1: 2802; Pricing 1: 1=1.33000, 10=1.23300, 100=0.89180 (USD); RoHS: Yes; Mount: Surface Mount; Case/Package: 1210; Min Operating Temperature: -40°C; Max Operating Temperature: 125°C; Max DC Current: 4.2A; Package Quantity: 250; Current Rating: 4.2A; Packaging: Tape and Reel; Composition: Wirewound; Termination: SMD/SMT; DC Current: 4.2A; Military Standard: Not; Inductance Tolerance: 20%; RMS Current (Irms): 4.2A; Length: 12mm; Height: 10mm; Width: 0.472inch; Height - Seated (Max): 0.394inch; Depth: 12.5mm; REACH SVHC: No SVHC; ComponentLink1URL: https://datasheet.ciiva.com/11799/0900766b80f2b72a-11799776.pdf?src-supplier=RSComponents; ComponentLink1Description: https://datasheet.ciiva.com/11799/0900766b80f2b72a-11799776.pdf?src-supplier=RSComponents; ComponentLink2URL: https://datasheet.ciiva.com/1073/srr1210-1073552.pdf?src-supplier=Digi-Key; ComponentLink2Description: https://datasheet.ciiva.com/1073/srr1210-1073552.pdf?src-supplier=Digi-Key; ComponentLink3URL: https://datasheet.ciiva.com/1073/srr1210-1073553.pdf?src-supplier=Digi-Key; ComponentLink3Description: https://datasheet.ciiva.com/1073/srr1210-1073553.pdf?src-supplier=Digi-Key; ComponentLink4URL: https://datasheet.ciiva.com/17285/srr1210-17285947.pdf?src-supplier=Avnet+Europe; ComponentLink4Description: https://datasheet.ciiva.com/17285/srr1210-17285947.pdf?src-supplier=Avnet+Europe; ComponentLink5URL: https://datasheet.ciiva.com/46437/1430851-46437259.pdf?src-supplier=Element14; ComponentLink5Description: https://datasheet.ciiva.com/46437/1430851-46437259.pdf?src-supplier=Element14; ComponentLink6URL: https://datasheet.ciiva.com/6697/srr1210-6697628.pdf?src-supplier=Digi-Key; ComponentLink6Description: https://datasheet.ciiva.com/6697/srr1210-6697628.pdf?src-supplier=Digi-Key; ComponentLink7URL: https://datasheet.ciiva.com/48684/srr1210-48684956.pdf?src-supplier=Avnet; ComponentLink7Description: https://datasheet.ciiva.com/48684/srr1210-48684956.pdf?src-supplier=Avnet; Supplier Part Number 1: SRR1210-390MCT-ND
LED10 = LED GREEN 0603: Manufacturer: Lite-On Inc.; Manufacturer P/N: LTST-C190KGKT; Digikey P/N: 160-1435-1-ND; Package / Case: 0603; Color: GREEN
R147 = CSNL1206FT2L00TR: as R2 on sheet bus_filter; ComponentLink1URL: https://www.seielect.com/Catalog/SEI-CSNL.pdf?src-supplier=Avnet; ComponentLink1Description: https://www.seielect.com/Catalog/SEI-CSNL.pdf?src-supplier=Avnet; ComponentLink2URL: https://www.seielect.com/catalog/SEI-Packaging.pdf?src-supplier=Digi-Key; ComponentLink2Description: https://www.seielect.com/catalog/SEI-Packaging.pdf?src-supplier=Digi-Key; Supplier 1: Digi-Key; Manufacturer Part Number: CSNL1206FT2L00; Stock 1: 23112; Pricing 1: 1=0.68, 10=0.566, 25=0.4852, 50=0.4366, 100=0.38, 250=0.33956, 500=0.2749, 1000=0.22234 (USD); Mount: Surface Mount; Case/Package: 1206; Case Code (Metric): 3216; Case Code (Imperial): 1206; Contact Plating: Tin,Matte; Min Operating Temperature: -55°C; Max Operating Temperature: 170°C; Packaging: Tape and Reel; Tolerance: 1%; Power Rating: 1W; Composition: Metal Foil; Number of Terminations: 2; Max Power Dissipation: 1W; Features: Moisture Resistant; Length: 0.126inch; Height: 0.035inch; Width: 0.063inch; Radiation Hardening: No; Lead Free: Lead Free; Supplier Part Number 1: CSNL1206FT2L00DKR-ND
R148 = ERJ-P06J102V: RES SMD 1K OHM 5% 1/2W 0805; Manufacturer: Panasonic Electronic Components; Factory Stock: 0; Unit Price (USD): 0.01839; @ qty: 1500; Minimum Quantity: 1; Power (Watts): 0.5W, 1/2W; Temperature Coefficient: ±200ppm/°C; Part Number: ERJ-P06J102V; Datasheets: https://industrial.panasonic.com/cdbs/www-data/pdf/RDA0000/AOA0000C243.pdf; Image: //media.digikey.com/Renders/Panasonic%20Renders/ERJ-0805%20Pkg.jpg; Digi-Key Part Number: P1.0KADCT-ND; Quantity Available: 124757; Packaging: Cut Tape (CT); Series: ERJ; Part Status: Active; Value: 1k; Tolerance: ±5%; Composition: Thick Film; Features: Automotive AEC-Q200, Pulse Withstanding; Operating Temperature: -55°C ~ 155°C; Package / Case: 0805 (2012 Metric); Supplier Device Package: 0805; Size / Dimension: 0.079" L x 0.049" W (2.00mm x 1.25mm); Height - Seated (Max): 0.028" (0.70mm); Number of Terminations: 2; Failure Rate: -
R149 R154 R156 = ERJ-P06J103V: as R6 on sheet bus_filter; Part Number: ERJ-P06J103V; Datasheets: https://industrial.panasonic.com/cdbs/www-data/pdf/RDA0000/AOA0000C243.pdf; Image: //media.digikey.com/Renders/Panasonic%20Renders/ERJ-0805%20Pkg.jpg; Digi-Key Part Number: P10KADCT-ND; Quantity Available: 413576; Packaging: Cut Tape (CT); Series: ERJ; Part Status: Active; Value: 10k; Tolerance: ±5%; Composition: Thick Film; Features: Automotive AEC-Q200, Pulse Withstanding; Operating Temperature: -55°C ~ 155°C; Package / Case: 0805 (2012 Metric); Supplier Device Package: 0805; Size / Dimension: 0.079" L x 0.049" W (2.00mm x 1.25mm); Height - Seated (Max): 0.028" (0.70mm); Number of Terminations: 2; Failure Rate: -
R150 = ERJ-P06J331V: RES SMD 330 OHM 5% 1/2W 0805; Manufacturer: Panasonic Electronic Components; Factory Stock: 0; Unit Price (USD): 0.01839; @ qty: 1500; Minimum Quantity: 1; Power (Watts): 0.5W, 1/2W; Temperature Coefficient: ±200ppm/°C; Part Number: ERJ-P06J331V; Datasheets: https://industrial.panasonic.com/cdbs/www-data/pdf/RDA0000/AOA0000C243.pdf; Image: //media.digikey.com/Renders/Panasonic%20Renders/ERJ-0805%20Pkg.jpg; Digi-Key Part Number: P330ADCT-ND; Quantity Available: 74125; Packaging: Cut Tape (CT); Series: ERJ; Part Status: Active; Value: 330; Tolerance: ±5%; Composition: Thick Film; Features: Automotive AEC-Q200, Pulse Withstanding; Operating Temperature: -55°C ~ 155°C; Package / Case: 0805 (2012 Metric); Supplier Device Package: 0805; Size / Dimension: 0.079" L x 0.049" W (2.00mm x 1.25mm); Height - Seated (Max): 0.028" (0.70mm); Number of Terminations: 2; Failure Rate: -
R151 = ERJ-P6WF1801V: RES SMD 1.8K OHM 1% 1/2W 0805; Manufacturer: Panasonic Electronic Components; Factory Stock: 0; Unit Price (USD): 0.10507; @ qty: 1500; Minimum Quantity: 1; Power (Watts): 0.5W, 1/2W; Temperature Coefficient: ±200ppm/°C; Part Number: ERJ-P6WF1801V; Datasheets: https://industrial.panasonic.com/cdbs/www-data/pdf/RDA0000/AOA0000C243.pdf; Image: //media.digikey.com/Renders/Panasonic%20Renders/ERJ-0805%20Pkg.jpg; Digi-Key Part Number: P16888CT-ND; Quantity Available: 1027; Packaging: Cut Tape (CT); Series: ERJ; Part Status: Active; Value: 1.8k; Tolerance: ±1%; Composition: Thick Film; Features: Automotive AEC-Q200, Pulse Withstanding; Operating Temperature: -55°C ~ 155°C; Package / Case: 0805 (2012 Metric); Supplier Device Package: 0805; Size / Dimension: 0.079" L x 0.049" W (2.00mm x 1.25mm); Height - Seated (Max): 0.030" (0.75mm); Number of Terminations: 2; Failure Rate: -
R152 R155 = ERJ-6ENF3002V: as R5 on sheet bus_filter; Part Number: ERJ-6ENF3002V; Datasheets: http://industrial.panasonic.com/www-cgi/jvcr13pz.cgi?E+PZ+3+AOA0002+ERJ6ENF3002V+7+WW; Image: //media.digikey.com/Renders/Panasonic%20Renders/ERJ-0805%20Pkg.jpg; Digi-Key Part Number: P30.0KCCT-ND; Quantity Available: 88046; Packaging: Cut Tape (CT); Series: ERJ; Part Status: Active; Value: 30k; Tolerance: ±1%; Composition: Thick Film; Features: Automotive AEC-Q200; Operating Temperature: -55°C ~ 155°C; Package / Case: 0805 (2012 Metric); Supplier Device Package: 0805; Size / Dimension: 0.079" L x 0.049" W (2.00mm x 1.25mm); Height - Seated (Max): 0.028" (0.70mm); Number of Terminations: 2; Failure Rate: -
R153 R157 = ERJ-6GEY0R00V: RES SMD 0.0 OHM JUMPER 1/8W 0805; Manufacturer: Panasonic Electronic Components; Factory Stock: 0; Unit Price (USD): 0.00544; @ qty: 1500; Minimum Quantity: 1; Power (Watts): 0.125W, 1/8W; Part Number: ERJ-6GEY0R00V; Datasheets: http://industrial.panasonic.com/www-cgi/jvcr13pz.cgi?E+PZ+3+AOA0001+ERJ6GEY0R00V+7+WW; Image: //media.digikey.com/Renders/Panasonic%20Renders/ERJ-0805%20Pkg.jpg; Digi-Key Part Number: P0.0ACT-ND; Quantity Available: 1597627; Packaging: Cut Tape (CT); Series: ERJ; Part Status: Active; Value: 0.0; Tolerance: Jumper; Composition: Thick Film; Features: Automotive AEC-Q200; Temperature Coefficient: -; Operating Temperature: -55°C ~ 155°C; Package / Case: 0805 (2012 Metric); Supplier Device Package: 0805; Size / Dimension: 0.079" L x 0.049" W (2.00mm x 1.25mm); Height - Seated (Max): 0.028" (0.70mm); Number of Terminations: 2; Failure Rate: -
TP86-TP93 = TP: SMD TEST POINT
U5 = TL072CDR: as U2 on sheet bus_filter; Supplier 1: Digi-Key; Stock 1: 21821; Pricing 1: 1=0.41, 10=0.334, 100=0.2059, 500=0.1562, 1000=0.11715 (USD); Case/Package: D; Number of Pins: 8; Contact Plating: Gold; Min Operating Temperature: -40°C; Max Operating Temperature: 85°C; Package Quantity: 1; Packaging: Tape and Reel; Unity Gain Bandwidth Product: 3MHz; Bandwidth: 3MHz; Nominal Gain Bandwidth Product: 3MHz; Number of Circuits: 2; Gain Bandwidth Product: 3MHz; Input Offset Voltage (Vos): 10mV; Number of Elements: 2; Max Supply Voltage: 18V; Number of Amplifiers: 2; Length: 4.9mm; Height: 1.58mm; Width: 3.91mm; Radiation Hardening: No; Lead Free: Lead Free; REACH SVHC: No SVHC; ComponentLink1URL: http://www.ti.com/lit/ds/symlink/tl071a.pdf?src-supplier=Digi-Key; ComponentLink1Description: http://www.ti.com/lit/ds/symlink/tl071a.pdf?src-supplier=Digi-Key; ComponentLink2URL: http://www.ti.com/general/docs/lit/getliterature.tsp?genericPartNumber=TL072&&fileType=pdf&src-supplier=Avnet; ComponentLink2Description: http://www.ti.com/general/docs/lit/getliterature.tsp?genericPartNumber=TL072&&fileType=pdf&src-supplier=Avnet; ComponentLink3URL: http://www.farnell.com/datasheets/1882732.pdf?src-supplier=Element14; ComponentLink3Description: http://www.farnell.com/datasheets/1882732.pdf?src-supplier=Element14; Supplier Part Number 1: 296-1282-6-ND; Manufacturer Part Number: TL072CDR
U24 = TPS5420: 5.5V to 36V Input, 2A, 500kHz Step-Down Converter; Manufacturer: Texas Instruments; Output Voltage: 31V; Quiescent Current: 3mA; Number of Outputs: 1; Synchronous Rectifier: No; Min Output Voltage: 1.23V; Output Type: Adjustable; Efficiency: 95%; Supplier 1: Digi-Key; Stock 1: 5221; Pricing 1: 1=3.78000, 10=3.39400, 75=3.20853, 150=2.78073, 525=2.36716, 1050=1.99640, 2550=1.89658, 5025=1.82528 (USD); RoHS: Yes; Case/Package: D; Number of Pins: 8; Weight: 0.002677oz; Min Operating Temperature: -40°C; Max Operating Temperature: 125°C; Output Current: 2A; Switching Frequency: 500kHz; Packaging: Rail/Tube; Package Quantity: 75; Max Input Voltage: 36V; Min Input Voltage: 5.5V; Max Output Voltage: 31V; Max Output Current: 2A; Operating Supply Voltage: 36V; Length: 4.9mm; Height: 1.58mm; Width: 3.91mm; Radiation Hardening: No; Lead Free: Lead Free; REACH SVHC: No SVHC; ComponentLink1URL: https://datasheet.ciiva.com/4880/slvs642c-120503-4880259.pdf?src-supplier=Mouser; ComponentLink1Description: https://datasheet.ciiva.com/4880/slvs642c-120503-4880259.pdf?src-supplier=Mouser; ComponentLink2URL: https://datasheet.ciiva.com/15113/getdatasheetpartid-188336-15113748.pdf?src-supplier=Verical; ComponentLink2Description: https://datasheet.ciiva.com/15113/getdatasheetpartid-188336-15113748.pdf?src-supplier=Verical; ComponentLink3URL: https://datasheet.ciiva.com/27051/1113040-27051457.pdf?src-supplier=Jameco; ComponentLink3Description: https://datasheet.ciiva.com/27051/1113040-27051457.pdf?src-supplier=Jameco; ComponentLink4URL: https://datasheet.ciiva.com/26896/tps5420d-26896666.pdf?src-supplier=IIIC; ComponentLink4Description: https://datasheet.ciiva.com/26896/tps5420d-26896666.pdf?src-supplier=IIIC; ComponentLink5URL: https://datasheet.ciiva.com/2026/tps5420-2026757.pdf?src-supplier=Digi-Key; ComponentLink5Description: https://datasheet.ciiva.com/2026/tps5420-2026757.pdf?src-supplier=Digi-Key; ComponentLink6URL: https://datasheet.ciiva.com/7993/1764415-7993820.pdf?src-supplier=Element14; ComponentLink6Description: https://datasheet.ciiva.com/7993/1764415-7993820.pdf?src-supplier=Element14; ComponentLink7URL: https://datasheet.ciiva.com/3220/tps5420-3220182.pdf?src-supplier=Avnet; ComponentLink7Description: https://datasheet.ciiva.com/3220/tps5420-3220182.pdf?src-supplier=Avnet; ComponentLink8URL: https://datasheet.ciiva.com/26248/tps5420-26248554.pdf?src-supplier=Avnet+Europe; ComponentLink8Description: https://datasheet.ciiva.com/26248/tps5420-26248554.pdf?src-supplier=Avnet+Europe; Supplier Part Number 1: 296-19671-5-ND
U25 = INA240A3: as U1 on sheet bus_filter; Supplier 1: Digi-Key; Stock 1: 4680; Pricing 1: 1=2.65, 10=2.377, 25=2.2428, 100=1.7943, 250=1.56996, 500=1.52512, 1000=1.21113 (USD); Mount: Surface Mount; Case/Package: TSSOP; Number of Pins: 8; Min Operating Temperature: -40°C; Max Operating Temperature: 125°C; Packaging: Tape and Reel; ComponentLink1URL: http://www.ti.com/general/docs/lit/getliterature.tsp?genericPartNumber=INA240&fileType=pdf&src-supplier=Farnell; ComponentLink1Description: http://www.ti.com/general/docs/lit/getliterature.tsp?genericPartNumber=INA240&fileType=pdf&src-supplier=Farnell; ComponentLink2URL: http://www.ti.com/lit/ds/symlink/ina240.pdf?src-supplier=Digi-Key; ComponentLink2Description: http://www.ti.com/lit/ds/symlink/ina240.pdf?src-supplier=Digi-Key; Supplier Part Number 1: 296-45090-1-ND